# Altium schematic sheet УШЯИ.411618.029Э Э3 Лист 7.schdoc: УШЯИ.411618.029Э
size 420 x 297 mm; SheetNumber: 7; SheetTotal: 7; Time: УШЯИ.411618.029Э
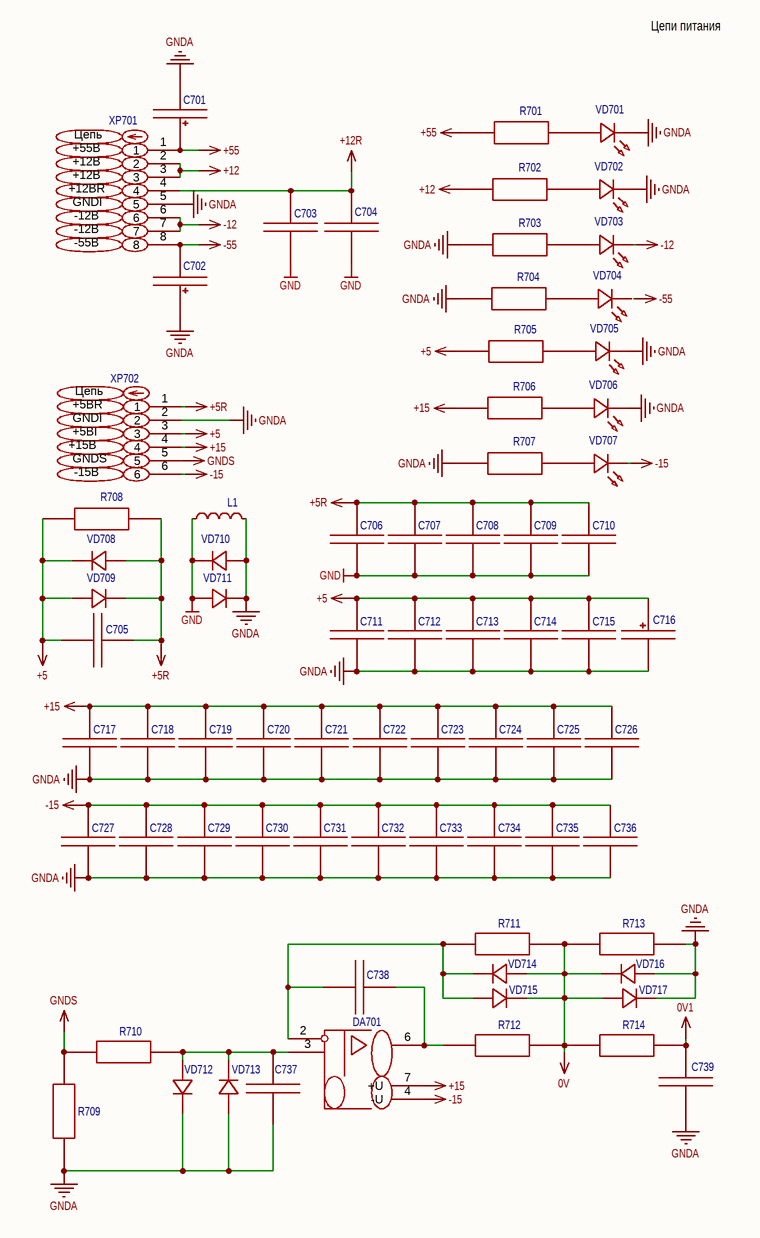
[diagram p0: УШЯИ.411618.029Э Э3 Лист 7.schdoc]

## Parts
C701  ECAP (К50-35), 4.7мкФ, 100В, 105°C, 5x11, p:2мм  [CAP-TH_BD5.0-P2.00-D0.8-FD]  (value not drawn)
C702  ECAP (К50-35), 4.7мкФ, 100В, 105°C, 5x11, p:2мм  [CAP-TH_BD5.0-P2.00-D0.8-FD]  (value not drawn)
C703  Конденсатор SMD 1мкФ 100В X7R 10% [0805]  [C0805]  (value not drawn)
C704  Конденсатор SMD 1мкФ 100В X7R 10% [0805]  [C0805]  (value not drawn)
C705  Конденсатор SMD 3300пФ 100В X7R 10% [0805]  [C0805]  (value not drawn)
C706  Конденсатор SMD 0,33мкФ 100В X7R 10% [0805]  [C0805]  (value not drawn)
C707  Конденсатор SMD 0,33мкФ 100В X7R 10% [0805]  [C0805]  (value not drawn)
C708  Конденсатор SMD 0,33мкФ 100В X7R 10% [0805]  [C0805]  (value not drawn)
C709  Конденсатор SMD 0,33мкФ 100В X7R 10% [0805]  [C0805]  (value not drawn)
C710  Конденсатор SMD 0,33мкФ 100В X7R 10% [0805]  [C0805]  (value not drawn)
C711  Конденсатор SMD 0,33мкФ 100В X7R 10% [0805]  [C0805]  (value not drawn)
C712  Конденсатор SMD 0,33мкФ 100В X7R 10% [0805]  [C0805]  (value not drawn)
C713  Конденсатор SMD 0,33мкФ 100В X7R 10% [0805]  [C0805]  (value not drawn)
C714  Конденсатор SMD 0,33мкФ 100В X7R 10% [0805]  [C0805]  (value not drawn)
C715  Конденсатор SMD 0,33мкФ 100В X7R 10% [0805]  [C0805]  (value not drawn)
C716  ECAP (К50-35), 4.7мкФ, 100В, 105°C, 5x11, p:2мм  [CAP-TH_BD5.0-P2.00-D0.8-FD]  (value not drawn)
C717  Конденсатор SMD 0,33мкФ 100В X7R 10% [0805]  [C0805]  (value not drawn)
C718  Конденсатор SMD 0,33мкФ 100В X7R 10% [0805]  [C0805]  (value not drawn)
C719  Конденсатор SMD 0,33мкФ 100В X7R 10% [0805]  [C0805]  (value not drawn)
C720  Конденсатор SMD 0,33мкФ 100В X7R 10% [0805]  [C0805]  (value not drawn)
C721  Конденсатор SMD 0,33мкФ 100В X7R 10% [0805]  [C0805]  (value not drawn)
C722  Конденсатор SMD 0,33мкФ 100В X7R 10% [0805]  [C0805]  (value not drawn)
C723  Конденсатор SMD 0,33мкФ 100В X7R 10% [0805]  [C0805]  (value not drawn)
C724  Конденсатор SMD 0,33мкФ 100В X7R 10% [0805]  [C0805]  (value not drawn)
C725  Конденсатор SMD 0,33мкФ 100В X7R 10% [0805]  [C0805]  (value not drawn)
C726  Конденсатор SMD 0,33мкФ 100В X7R 10% [0805]  [C0805]  (value not drawn)
C727  Конденсатор SMD 0,33мкФ 100В X7R 10% [0805]  [C0805]  (value not drawn)
C728  Конденсатор SMD 0,33мкФ 100В X7R 10% [0805]  [C0805]  (value not drawn)
C729  Конденсатор SMD 0,33мкФ 100В X7R 10% [0805]  [C0805]  (value not drawn)
C730  Конденсатор SMD 0,33мкФ 100В X7R 10% [0805]  [C0805]  (value not drawn)
C731  Конденсатор SMD 0,33мкФ 100В X7R 10% [0805]  [C0805]  (value not drawn)
C732  Конденсатор SMD 0,33мкФ 100В X7R 10% [0805]  [C0805]  (value not drawn)
C733  Конденсатор SMD 0,33мкФ 100В X7R 10% [0805]  [C0805]  (value not drawn)
C734  Конденсатор SMD 0,33мкФ 100В X7R 10% [0805]  [C0805]  (value not drawn)
C735  Конденсатор SMD 0,33мкФ 100В X7R 10% [0805]  [C0805]  (value not drawn)
C736  Конденсатор SMD 0,33мкФ 100В X7R 10% [0805]  [C0805]  (value not drawn)
C737  Конденсатор SMD 2,2мкФ 100В X7R 10% [0805]  [C0805]  (value not drawn)
C738  Конденсатор SMD 240пФ 100В X7R 10% [0805]  [C0805]  (value not drawn)
C739  Конденсатор SMD 680пФ 100В X7R 10% [0805]  [C0805]  (value not drawn)
DA701  Операционный усилитель AD8671ARZ [SOIC-8]  [SOIC-8_L4.9-W3.9-P1.27-LS6.0-BL]  (value not drawn)
L1  Дроссель LQH55DN101M01 [2220]  [L2220]  (value not drawn)
R701  Резистор 3кОм 0,125Вт 1% [0805]  [R0805]  (value not drawn)
R702  Резистор 510Ом 0,125Вт 1% [0805]  [R0805]  (value not drawn)
R703  Резистор 510Ом 0,125Вт 1% [0805]  [R0805]  (value not drawn)
R704  Резистор 3кОм 0,125Вт 1% [0805]  [R0805]  (value not drawn)
R705  Резистор 150Ом 0,125Вт 1% [0805]  [R0805]  (value not drawn)
R706  Резистор 1кОм 0,125Вт 1% [0805]  [R0805]  (value not drawn)
R707  Резистор 1кОм 0,125Вт 1% [0805]  [R0805]  (value not drawn)
R708  Резистор 240Ом 0,125Вт 1% [0805]  [R0805]  (value not drawn)
R709  Резистор 1,1кОм 0,125Вт 1% [0805]  [R0805]  (value not drawn)
R710  Резистор 1,1кОм 0,125Вт 1% [0805]  [R0805]  (value not drawn)
R711  Резистор 1,1кОм 0,125Вт 1% [0805]  [R0805]  (value not drawn)
R712  Резистор 22 кОм 0,125Вт 1% [0805]  [R0805]  (value not drawn)
R713  Резистор 330Ом 0,125Вт 1% [0805]  [R0805]  (value not drawn)
R714  Резистор 22 кОм 0,125Вт 1% [0805]  [R0805]  (value not drawn)
VD701  Светодиод YLED0805YG [0805]  [LED0805-R-RD]  (value not drawn)
VD702  Светодиод YLED0805YG [0805]  [LED0805-R-RD]  (value not drawn)
VD703  Светодиод YLED0805YG [0805]  [LED0805-R-RD]  (value not drawn)
VD704  Светодиод YLED0805YG [0805]  [LED0805-R-RD]  (value not drawn)
VD705  Светодиод YLED0805YG [0805]  [LED0805-R-RD]  (value not drawn)
VD706  Светодиод YLED0805YG [0805]  [LED0805-R-RD]  (value not drawn)
VD707  Светодиод YLED0805YG [0805]  [LED0805-R-RD]  (value not drawn)
VD708  Диод импульсный 1N4448 [SOD-123]  [SOD-123_L2.7-W1.6-LS3.7-RD-1]  (value not drawn)
VD709  Диод импульсный 1N4448 [SOD-123]  [SOD-123_L2.7-W1.6-LS3.7-RD-1]  (value not drawn)
VD710  Диод импульсный 1N4448 [SOD-123]  [SOD-123_L2.7-W1.6-LS3.7-RD-1]  (value not drawn)
VD711  Диод импульсный 1N4448 [SOD-123]  [SOD-123_L2.7-W1.6-LS3.7-RD-1]  (value not drawn)
VD712  Диод импульсный 1N4448 [SOD-123]  [SOD-123_L2.7-W1.6-LS3.7-RD-1]  (value not drawn)
VD713  Диод импульсный 1N4448 [SOD-123]  [SOD-123_L2.7-W1.6-LS3.7-RD-1]  (value not drawn)
VD714  Диод импульсный 1N4448 [SOD-123]  [SOD-123_L2.7-W1.6-LS3.7-RD-1]  (value not drawn)
VD715  Диод импульсный 1N4448 [SOD-123]  [SOD-123_L2.7-W1.6-LS3.7-RD-1]  (value not drawn)
VD716  Диод импульсный 1N4448 [SOD-123]  [SOD-123_L2.7-W1.6-LS3.7-RD-1]  (value not drawn)
VD717  Диод импульсный 1N4448 [SOD-123]  [SOD-123_L2.7-W1.6-LS3.7-RD-1]  (value not drawn)
XP701  Вилка на плату 280373-2 шаг 2.54мм  [CONN-TH_8P-P2.54_280373-1]  (value not drawn)
XP702  Вилка на плату 280372-2 шаг 2.54мм  [CONN-TH_DIP-6-2.54]  (value not drawn)

## Nets
0V: R711.1 R712.1 R713.2 R714.2 VD714.2(A) VD715.1(C) VD716.1(C) VD717.2(A)
0V1: C739.2 R714.1
+5: C705.2 C711.2 C712.2 C713.2 C714.2 C715.2 C716.1 R705.1 R708.1 VD708.1(C) VD709.2(A) XP702.3
+5R: C705.1 C706.2 C707.2 C708.2 C709.2 C710.2 R708.2 VD708.2(A) VD709.1(C) XP702.1
+12: R702.1 XP701.2 XP701.3
+12R: C703.2 C704.2 XP701.4
+15: C717.2 C718.2 C719.2 C720.2 C721.2 C722.2 C723.2 C724.2 C725.2 C726.2 DA701.7(+U) R706.1 XP702.4
+55: C701.1 R701.1 XP701.1
-12: VD703.2 XP701.6 XP701.7
-15: C727.2 C728.2 C729.2 C730.2 C731.2 C732.2 C733.2 C734.2 C735.2 C736.2 DA701.4(-U) VD707.2 XP702.6
-55: C702.2 XP701.8
GND: C703.1 C704.1 C706.1 C707.1 C708.1 C709.1 C710.1 L1.1 VD710.1(C) VD711.2(A)
GNDA: C701.2 C702.1 C711.1 C712.1 C713.1 C714.1 C715.1 C716.2 C717.1 C718.1 C719.1 C720.1 C721.1 C722.1 C723.1 C724.1 C725.1 C726.1 C727.1 C728.1 C729.1 C730.1 C731.1 C732.1 C733.1 C734.1 C735.1 C736.1 C737.2 C739.1 L1.2 R703.1 R704.1 R707.1 R709.2 R713.1 VD701.2 VD702.2 VD705.2 VD706.2 VD710.2(A) VD711.1(C) VD712.1(C) VD713.2(A) VD716.2(A) VD717.1(C) XP701.5 XP702.2
GNDS: R709.1 R710.2 XP702.5
NetC737_1: C737.1 DA701.3(+IN) R710.1 VD712.2(A) VD713.1(C)
NetC738_1: C738.1 DA701.2(-IN) R711.2 VD714.1(C) VD715.2(A)
NetC738_2: C738.2 DA701.6(OUT) R712.2
NetR701_2: R701.2 VD701.1
NetR702_2: R702.2 VD702.1
NetR703_2: R703.2 VD703.1
NetR704_2: R704.2 VD704.1
NetR705_2: R705.2 VD705.1
NetR706_2: R706.2 VD706.1
NetR707_2: R707.2 VD707.1

Not connected (* = marked no-connect by the designer): VD704 2

## Notes on the sheet
- Цепи питания
- (near XP701) +55B
- (near XP701) +12B
- (near XP701) +12BR
- (near XP701) GNDI
- (near XP701) -12B
- (near XP701) -55B
- +15B
- +5BI
- (near XP702) GNDI
- (near XP702) +5BR
- GNDS
- -15B
- Подп. и дата
- Инв.№ дубл.
- Взам.инв.№
- Подп.и дата
- Инв.№ подл.
- Изм.
- Лист
- № докум.
- Подп.
- Дата
- Формат  A3
- (in symbol Вилка на плату 280372-2 шаг 2.54мм) Цепь
- (in symbol Вилка на плату 280373-2 шаг 2.54мм) Цепь

## Library data of the parts
C701 = ECAP (К50-35), 4.7мкФ, 100В, 105°C, 5x11, p:2мм: Manufacturer: Chengx; nameAlias: Value; Contributor: jordanjin; Convert to PCB: yes; UniqueId: ggec79a695c238429b4; Origin Footprint: CAP-TH_BD5.0-P2.00-D0.8-FD; Device: ECAP (К50-35), 4.7мкФ, 100В, 105°C, 5x11, p:2мм; Symbol: ECAP (К50-35), 4.7мкФ, 100В, 105°C, 5x11, p:2мм; Supplier: LCSC; Manufacturer Part: ECAP (К50-35), 4.7мкФ, 100В, 105°C, 5x11, p:2мм; JLCPCB Part Class: Extended Part; spicePre: C; spiceSymbolName: ECAP (К50-35), 4.7мкФ, 100В, 105°C, 5x11, p:2мм; Add into BOM: yes; FootprintName: CAP-TH_BD5.0-P2.00-D0.8-FD
C702 = ECAP (К50-35), 4.7мкФ, 100В, 105°C, 5x11, p:2мм: Manufacturer: Chengx; nameAlias: Value; Contributor: jordanjin; Convert to PCB: yes; UniqueId: ggeb00718f5b1f7dec1; Origin Footprint: CAP-TH_BD5.0-P2.00-D0.8-FD; Device: ECAP (К50-35), 4.7мкФ, 100В, 105°C, 5x11, p:2мм; Symbol: ECAP (К50-35), 4.7мкФ, 100В, 105°C, 5x11, p:2мм; Supplier: LCSC; Manufacturer Part: ECAP (К50-35), 4.7мкФ, 100В, 105°C, 5x11, p:2мм; JLCPCB Part Class: Extended Part; spicePre: C; spiceSymbolName: ECAP (К50-35), 4.7мкФ, 100В, 105°C, 5x11, p:2мм; Add into BOM: yes; FootprintName: CAP-TH_BD5.0-P2.00-D0.8-FD
C703 = Конденсатор SMD 1мкФ 100В X7R 10% [0805]: Contributor: jordanjin; Convert to PCB: yes; UniqueId: gged413f6c6ee1c06eb; Origin Footprint: C0805; Device: Конденсатор SMD 1мкФ 100В X7R 10% [0805]; Symbol: Конденсатор SMD 1мкФ 100В X7R 10% [0805]; Manufacturer Part: C0805; spicePre: C; spiceSymbolName: Конденсатор SMD 100нФ 100В X7R 10% [0805]; Add into BOM: yes; FootprintName: C0805
C704 = Конденсатор SMD 1мкФ 100В X7R 10% [0805]: Contributor: jordanjin; Convert to PCB: yes; UniqueId: gge57e83f5dac66d963; Origin Footprint: C0805; Device: Конденсатор SMD 1мкФ 100В X7R 10% [0805]; Symbol: Конденсатор SMD 1мкФ 100В X7R 10% [0805]; Manufacturer Part: C0805; spicePre: C; spiceSymbolName: Конденсатор SMD 100нФ 100В X7R 10% [0805]; Add into BOM: yes; FootprintName: C0805
C705 = Конденсатор SMD 3300пФ 100В X7R 10% [0805]: Contributor: jordanjin; Convert to PCB: yes; UniqueId: gge41996877947d4b8f; Origin Footprint: C0805; Device: Конденсатор SMD 3300пФ 100В X7R 10% [0805]; Symbol: Конденсатор SMD 3300пФ 100В X7R 10% [0805]; Manufacturer Part: C0805; spicePre: C; spiceSymbolName: Конденсатор SMD 100нФ 100В X7R 10% [0805]; Add into BOM: yes; FootprintName: C0805
C706 = Конденсатор SMD 0,33мкФ 100В X7R 10% [0805]: Contributor: jordanjin; Convert to PCB: yes; UniqueId: gge2c99e2c9b5d02610; Origin Footprint: C0805; Device: Конденсатор SMD 0,33мкФ 100В X7R 10% [0805]; Symbol: Конденсатор SMD 0,33мкФ 100В X7R 10% [0805]; Manufacturer Part: C0805; spicePre: C; spiceSymbolName: Конденсатор SMD 100нФ 100В X7R 10% [0805]; Add into BOM: yes; FootprintName: C0805
C707 = Конденсатор SMD 0,33мкФ 100В X7R 10% [0805]: Contributor: jordanjin; Convert to PCB: yes; UniqueId: gge8f710507705d2100; Origin Footprint: C0805; Device: Конденсатор SMD 0,33мкФ 100В X7R 10% [0805]; Symbol: Конденсатор SMD 0,33мкФ 100В X7R 10% [0805]; Manufacturer Part: C0805; spicePre: C; spiceSymbolName: Конденсатор SMD 100нФ 100В X7R 10% [0805]; Add into BOM: yes; FootprintName: C0805
C708 = Конденсатор SMD 0,33мкФ 100В X7R 10% [0805]: Contributor: jordanjin; Convert to PCB: yes; UniqueId: gge978881400ca0cd87; Origin Footprint: C0805; Device: Конденсатор SMD 0,33мкФ 100В X7R 10% [0805]; Symbol: Конденсатор SMD 0,33мкФ 100В X7R 10% [0805]; Manufacturer Part: C0805; spicePre: C; spiceSymbolName: Конденсатор SMD 100нФ 100В X7R 10% [0805]; Add into BOM: yes; FootprintName: C0805
C709 = Конденсатор SMD 0,33мкФ 100В X7R 10% [0805]: Contributor: jordanjin; Convert to PCB: yes; UniqueId: ggeffa3e215b4406635; Origin Footprint: C0805; Device: Конденсатор SMD 0,33мкФ 100В X7R 10% [0805]; Symbol: Конденсатор SMD 0,33мкФ 100В X7R 10% [0805]; Manufacturer Part: C0805; spicePre: C; spiceSymbolName: Конденсатор SMD 100нФ 100В X7R 10% [0805]; Add into BOM: yes; FootprintName: C0805
C710 = Конденсатор SMD 0,33мкФ 100В X7R 10% [0805]: Contributor: jordanjin; Convert to PCB: yes; UniqueId: ggee3b30f4a3e05f17b; Origin Footprint: C0805; Device: Конденсатор SMD 0,33мкФ 100В X7R 10% [0805]; Symbol: Конденсатор SMD 0,33мкФ 100В X7R 10% [0805]; Manufacturer Part: C0805; spicePre: C; spiceSymbolName: Конденсатор SMD 100нФ 100В X7R 10% [0805]; Add into BOM: yes; FootprintName: C0805
C711 = Конденсатор SMD 0,33мкФ 100В X7R 10% [0805]: Contributor: jordanjin; Convert to PCB: yes; UniqueId: gge0fe80393a9613bd8; Origin Footprint: C0805; Device: Конденсатор SMD 0,33мкФ 100В X7R 10% [0805]; Symbol: Конденсатор SMD 0,33мкФ 100В X7R 10% [0805]; Manufacturer Part: C0805; spicePre: C; spiceSymbolName: Конденсатор SMD 100нФ 100В X7R 10% [0805]; Add into BOM: yes; FootprintName: C0805
C712 = Конденсатор SMD 0,33мкФ 100В X7R 10% [0805]: Contributor: jordanjin; Convert to PCB: yes; UniqueId: gge0eb5b0418183ff51; Origin Footprint: C0805; Device: Конденсатор SMD 0,33мкФ 100В X7R 10% [0805]; Symbol: Конденсатор SMD 0,33мкФ 100В X7R 10% [0805]; Manufacturer Part: C0805; spicePre: C; spiceSymbolName: Конденсатор SMD 100нФ 100В X7R 10% [0805]; Add into BOM: yes; FootprintName: C0805
C713 = Конденсатор SMD 0,33мкФ 100В X7R 10% [0805]: Contributor: jordanjin; Convert to PCB: yes; UniqueId: gge76f04a7dbfea72d7; Origin Footprint: C0805; Device: Конденсатор SMD 0,33мкФ 100В X7R 10% [0805]; Symbol: Конденсатор SMD 0,33мкФ 100В X7R 10% [0805]; Manufacturer Part: C0805; spicePre: C; spiceSymbolName: Конденсатор SMD 100нФ 100В X7R 10% [0805]; Add into BOM: yes; FootprintName: C0805
C714 = Конденсатор SMD 0,33мкФ 100В X7R 10% [0805]: Contributor: jordanjin; Convert to PCB: yes; UniqueId: gge51ad3bbaa36013da; Origin Footprint: C0805; Device: Конденсатор SMD 0,33мкФ 100В X7R 10% [0805]; Symbol: Конденсатор SMD 0,33мкФ 100В X7R 10% [0805]; Manufacturer Part: C0805; spicePre: C; spiceSymbolName: Конденсатор SMD 100нФ 100В X7R 10% [0805]; Add into BOM: yes; FootprintName: C0805
C715 = Конденсатор SMD 0,33мкФ 100В X7R 10% [0805]: Contributor: jordanjin; Convert to PCB: yes; UniqueId: ggea0d1a34ba46ee456; Origin Footprint: C0805; Device: Конденсатор SMD 0,33мкФ 100В X7R 10% [0805]; Symbol: Конденсатор SMD 0,33мкФ 100В X7R 10% [0805]; Manufacturer Part: C0805; spicePre: C; spiceSymbolName: Конденсатор SMD 100нФ 100В X7R 10% [0805]; Add into BOM: yes; FootprintName: C0805
C716 = ECAP (К50-35), 4.7мкФ, 100В, 105°C, 5x11, p:2мм: Manufacturer: Chengx; nameAlias: Value; Contributor: jordanjin; Convert to PCB: yes; UniqueId: gge8b239ae06b28e32d; Origin Footprint: CAP-TH_BD5.0-P2.00-D0.8-FD; Device: ECAP (К50-35), 4.7мкФ, 100В, 105°C, 5x11, p:2мм; Symbol: ECAP (К50-35), 4.7мкФ, 100В, 105°C, 5x11, p:2мм; Supplier: LCSC; Manufacturer Part: ECAP (К50-35), 4.7мкФ, 100В, 105°C, 5x11, p:2мм; JLCPCB Part Class: Extended Part; spicePre: C; spiceSymbolName: ECAP (К50-35), 4.7мкФ, 100В, 105°C, 5x11, p:2мм; Add into BOM: yes; FootprintName: CAP-TH_BD5.0-P2.00-D0.8-FD
C717 = Конденсатор SMD 0,33мкФ 100В X7R 10% [0805]: Contributor: jordanjin; Convert to PCB: yes; UniqueId: gge8d6ecc52b212946c; Origin Footprint: C0805; Device: Конденсатор SMD 0,33мкФ 100В X7R 10% [0805]; Symbol: Конденсатор SMD 0,33мкФ 100В X7R 10% [0805]; Manufacturer Part: C0805; spicePre: C; spiceSymbolName: Конденсатор SMD 100нФ 100В X7R 10% [0805]; Add into BOM: yes; FootprintName: C0805
C718 = Конденсатор SMD 0,33мкФ 100В X7R 10% [0805]: Contributor: jordanjin; Convert to PCB: yes; UniqueId: ggeb263bc4d5c0757bd; Origin Footprint: C0805; Device: Конденсатор SMD 0,33мкФ 100В X7R 10% [0805]; Symbol: Конденсатор SMD 0,33мкФ 100В X7R 10% [0805]; Manufacturer Part: C0805; spicePre: C; spiceSymbolName: Конденсатор SMD 100нФ 100В X7R 10% [0805]; Add into BOM: yes; FootprintName: C0805
C719 = Конденсатор SMD 0,33мкФ 100В X7R 10% [0805]: Contributor: jordanjin; Convert to PCB: yes; UniqueId: gge8279ce7d3c195481; Origin Footprint: C0805; Device: Конденсатор SMD 0,33мкФ 100В X7R 10% [0805]; Symbol: Конденсатор SMD 0,33мкФ 100В X7R 10% [0805]; Manufacturer Part: C0805; spicePre: C; spiceSymbolName: Конденсатор SMD 100нФ 100В X7R 10% [0805]; Add into BOM: yes; FootprintName: C0805
C720 = Конденсатор SMD 0,33мкФ 100В X7R 10% [0805]: Contributor: jordanjin; Convert to PCB: yes; UniqueId: ggef2a808055042e68f; Origin Footprint: C0805; Device: Конденсатор SMD 0,33мкФ 100В X7R 10% [0805]; Symbol: Конденсатор SMD 0,33мкФ 100В X7R 10% [0805]; Manufacturer Part: C0805; spicePre: C; spiceSymbolName: Конденсатор SMD 100нФ 100В X7R 10% [0805]; Add into BOM: yes; FootprintName: C0805
C721 = Конденсатор SMD 0,33мкФ 100В X7R 10% [0805]: Contributor: jordanjin; Convert to PCB: yes; UniqueId: gge29bc8f4a845388a2; Origin Footprint: C0805; Device: Конденсатор SMD 0,33мкФ 100В X7R 10% [0805]; Symbol: Конденсатор SMD 0,33мкФ 100В X7R 10% [0805]; Manufacturer Part: C0805; spicePre: C; spiceSymbolName: Конденсатор SMD 100нФ 100В X7R 10% [0805]; Add into BOM: yes; FootprintName: C0805
C722 = Конденсатор SMD 0,33мкФ 100В X7R 10% [0805]: Contributor: jordanjin; Convert to PCB: yes; UniqueId: gge53ad9dcacc4a4841; Origin Footprint: C0805; Device: Конденсатор SMD 0,33мкФ 100В X7R 10% [0805]; Symbol: Конденсатор SMD 0,33мкФ 100В X7R 10% [0805]; Manufacturer Part: C0805; spicePre: C; spiceSymbolName: Конденсатор SMD 100нФ 100В X7R 10% [0805]; Add into BOM: yes; FootprintName: C0805
C723 = Конденсатор SMD 0,33мкФ 100В X7R 10% [0805]: Contributor: jordanjin; Convert to PCB: yes; UniqueId: gge50c4013cebd6c9c5; Origin Footprint: C0805; Device: Конденсатор SMD 0,33мкФ 100В X7R 10% [0805]; Symbol: Конденсатор SMD 0,33мкФ 100В X7R 10% [0805]; Manufacturer Part: C0805; spicePre: C; spiceSymbolName: Конденсатор SMD 100нФ 100В X7R 10% [0805]; Add into BOM: yes; FootprintName: C0805
C724 = Конденсатор SMD 0,33мкФ 100В X7R 10% [0805]: Contributor: jordanjin; Convert to PCB: yes; UniqueId: ggeb9b96117afb50d93; Origin Footprint: C0805; Device: Конденсатор SMD 0,33мкФ 100В X7R 10% [0805]; Symbol: Конденсатор SMD 0,33мкФ 100В X7R 10% [0805]; Manufacturer Part: C0805; spicePre: C; spiceSymbolName: Конденсатор SMD 100нФ 100В X7R 10% [0805]; Add into BOM: yes; FootprintName: C0805
C725 = Конденсатор SMD 0,33мкФ 100В X7R 10% [0805]: Contributor: jordanjin; Convert to PCB: yes; UniqueId: gge849b9b6f05694942; Origin Footprint: C0805; Device: Конденсатор SMD 0,33мкФ 100В X7R 10% [0805]; Symbol: Конденсатор SMD 0,33мкФ 100В X7R 10% [0805]; Manufacturer Part: C0805; spicePre: C; spiceSymbolName: Конденсатор SMD 100нФ 100В X7R 10% [0805]; Add into BOM: yes; FootprintName: C0805
C726 = Конденсатор SMD 0,33мкФ 100В X7R 10% [0805]: Contributor: jordanjin; Convert to PCB: yes; UniqueId: gge7941181534d7c05c; Origin Footprint: C0805; Device: Конденсатор SMD 0,33мкФ 100В X7R 10% [0805]; Symbol: Конденсатор SMD 0,33мкФ 100В X7R 10% [0805]; Manufacturer Part: C0805; spicePre: C; spiceSymbolName: Конденсатор SMD 100нФ 100В X7R 10% [0805]; Add into BOM: yes; FootprintName: C0805
C727 = Конденсатор SMD 0,33мкФ 100В X7R 10% [0805]: Contributor: jordanjin; Convert to PCB: yes; UniqueId: ggee7ac6d5a3b31e9d6; Origin Footprint: C0805; Device: Конденсатор SMD 0,33мкФ 100В X7R 10% [0805]; Symbol: Конденсатор SMD 0,33мкФ 100В X7R 10% [0805]; Manufacturer Part: C0805; spicePre: C; spiceSymbolName: Конденсатор SMD 100нФ 100В X7R 10% [0805]; Add into BOM: yes; FootprintName: C0805
C728 = Конденсатор SMD 0,33мкФ 100В X7R 10% [0805]: Contributor: jordanjin; Convert to PCB: yes; UniqueId: gge3b117698605ce8f9; Origin Footprint: C0805; Device: Конденсатор SMD 0,33мкФ 100В X7R 10% [0805]; Symbol: Конденсатор SMD 0,33мкФ 100В X7R 10% [0805]; Manufacturer Part: C0805; spicePre: C; spiceSymbolName: Конденсатор SMD 100нФ 100В X7R 10% [0805]; Add into BOM: yes; FootprintName: C0805
C729 = Конденсатор SMD 0,33мкФ 100В X7R 10% [0805]: Contributor: jordanjin; Convert to PCB: yes; UniqueId: ggec6c710e3fae7596f; Origin Footprint: C0805; Device: Конденсатор SMD 0,33мкФ 100В X7R 10% [0805]; Symbol: Конденсатор SMD 0,33мкФ 100В X7R 10% [0805]; Manufacturer Part: C0805; spicePre: C; spiceSymbolName: Конденсатор SMD 100нФ 100В X7R 10% [0805]; Add into BOM: yes; FootprintName: C0805
C730 = Конденсатор SMD 0,33мкФ 100В X7R 10% [0805]: Contributor: jordanjin; Convert to PCB: yes; UniqueId: gged6096b43feaa1135; Origin Footprint: C0805; Device: Конденсатор SMD 0,33мкФ 100В X7R 10% [0805]; Symbol: Конденсатор SMD 0,33мкФ 100В X7R 10% [0805]; Manufacturer Part: C0805; spicePre: C; spiceSymbolName: Конденсатор SMD 100нФ 100В X7R 10% [0805]; Add into BOM: yes; FootprintName: C0805
C731 = Конденсатор SMD 0,33мкФ 100В X7R 10% [0805]: Contributor: jordanjin; Convert to PCB: yes; UniqueId: gge6db5aa1f37674ae5; Origin Footprint: C0805; Device: Конденсатор SMD 0,33мкФ 100В X7R 10% [0805]; Symbol: Конденсатор SMD 0,33мкФ 100В X7R 10% [0805]; Manufacturer Part: C0805; spicePre: C; spiceSymbolName: Конденсатор SMD 100нФ 100В X7R 10% [0805]; Add into BOM: yes; FootprintName: C0805
C732 = Конденсатор SMD 0,33мкФ 100В X7R 10% [0805]: Contributor: jordanjin; Convert to PCB: yes; UniqueId: ggeae336647d1fef108; Origin Footprint: C0805; Device: Конденсатор SMD 0,33мкФ 100В X7R 10% [0805]; Symbol: Конденсатор SMD 0,33мкФ 100В X7R 10% [0805]; Manufacturer Part: C0805; spicePre: C; spiceSymbolName: Конденсатор SMD 100нФ 100В X7R 10% [0805]; Add into BOM: yes; FootprintName: C0805
C733 = Конденсатор SMD 0,33мкФ 100В X7R 10% [0805]: Contributor: jordanjin; Convert to PCB: yes; UniqueId: gge73da1928ca5fe88b; Origin Footprint: C0805; Device: Конденсатор SMD 0,33мкФ 100В X7R 10% [0805]; Symbol: Конденсатор SMD 0,33мкФ 100В X7R 10% [0805]; Manufacturer Part: C0805; spicePre: C; spiceSymbolName: Конденсатор SMD 100нФ 100В X7R 10% [0805]; Add into BOM: yes; FootprintName: C0805
C734 = Конденсатор SMD 0,33мкФ 100В X7R 10% [0805]: Contributor: jordanjin; Convert to PCB: yes; UniqueId: gge35dd7582ea89825b; Origin Footprint: C0805; Device: Конденсатор SMD 0,33мкФ 100В X7R 10% [0805]; Symbol: Конденсатор SMD 0,33мкФ 100В X7R 10% [0805]; Manufacturer Part: C0805; spicePre: C; spiceSymbolName: Конденсатор SMD 100нФ 100В X7R 10% [0805]; Add into BOM: yes; FootprintName: C0805
C735 = Конденсатор SMD 0,33мкФ 100В X7R 10% [0805]: Contributor: jordanjin; Convert to PCB: yes; UniqueId: ggefea48fbf2fcabb1a; Origin Footprint: C0805; Device: Конденсатор SMD 0,33мкФ 100В X7R 10% [0805]; Symbol: Конденсатор SMD 0,33мкФ 100В X7R 10% [0805]; Manufacturer Part: C0805; spicePre: C; spiceSymbolName: Конденсатор SMD 100нФ 100В X7R 10% [0805]; Add into BOM: yes; FootprintName: C0805
C736 = Конденсатор SMD 0,33мкФ 100В X7R 10% [0805]: Contributor: jordanjin; Convert to PCB: yes; UniqueId: gged22cf9e48ac49b50; Origin Footprint: C0805; Device: Конденсатор SMD 0,33мкФ 100В X7R 10% [0805]; Symbol: Конденсатор SMD 0,33мкФ 100В X7R 10% [0805]; Manufacturer Part: C0805; spicePre: C; spiceSymbolName: Конденсатор SMD 100нФ 100В X7R 10% [0805]; Add into BOM: yes; FootprintName: C0805
C737 = Конденсатор SMD 2,2мкФ 100В X7R 10% [0805]: Contributor: jordanjin; Convert to PCB: yes; UniqueId: gge6dfac0ba330344ad; Origin Footprint: C0805; Device: Конденсатор SMD 2,2мкФ 100В X7R 10% [0805]; Symbol: Конденсатор SMD 2,2мкФ 100В X7R 10% [0805]; Manufacturer Part: C0805; spicePre: C; spiceSymbolName: Конденсатор SMD 100нФ 100В X7R 10% [0805]; Add into BOM: yes; FootprintName: C0805
C738 = Конденсатор SMD 240пФ 100В X7R 10% [0805]: Contributor: jordanjin; Convert to PCB: yes; UniqueId: ggec159c05867b449a9; Origin Footprint: C0805; Device: Конденсатор SMD 240пФ 100В X7R 10% [0805]; Symbol: Конденсатор SMD 240пФ 100В X7R 10% [0805]; Manufacturer Part: C0805; spicePre: C; spiceSymbolName: Конденсатор SMD 100нФ 100В X7R 10% [0805]; Add into BOM: yes; FootprintName: C0805
C739 = Конденсатор SMD 680пФ 100В X7R 10% [0805]: Contributor: jordanjin; Convert to PCB: yes; UniqueId: gge5808c3601932fb95; Origin Footprint: C0805; Device: Конденсатор SMD 680пФ 100В X7R 10% [0805]; Symbol: Конденсатор SMD 680пФ 100В X7R 10% [0805]; Manufacturer Part: C0805; spicePre: C; spiceSymbolName: Конденсатор SMD 100нФ 100В X7R 10% [0805]; Add into BOM: yes; FootprintName: C0805
DA701 = Операционный усилитель AD8671ARZ [SOIC-8]: Manufacturer: Analog Devices; Manufacturer Part: AD8671ARZ-REEL7; Contributor: jordanjin; Convert to PCB: yes; UniqueId: gge78f650f834d7221e; Origin Footprint: SOIC-8_L4.9-W3.9-P1.27-LS6.0-BL; Device: Операционный усилитель AD8671ARZ [SOIC-8]; Symbol: Операционный усилитель AD8671ARZ [SOIC-8]; Supplier: LCSC; Supplier Part: C56309; JLCPCB Part Class: Extended Part; spicePre: D; spiceSymbolName: Операционный усилитель AD8671ARZ [SOIC-8]; Add into BOM: yes; FootprintName: SOIC-8_L4.9-W3.9-P1.27-LS6.0-BL
L1 = Дроссель LQH55DN101M01 [2220]: Manufacturer: muRata(村田); nameAlias: Value; Convert to PCB: yes; UniqueId: ggee184eee05c7c2950; ModelId: d4c6f97e303e4b1b8669f70e4026b0f7; Origin Footprint: L2220; Device: Дроссель LQH55DN101M01 [2220]; Symbol: Дроссель LQH55DN101M01 [2220]; Supplier: LCSC; Manufacturer Part: LQH55DN101M01; Supplier Part: C98028; JLCPCB Part Class: Extended Part; spicePre: L; spiceSymbolName: LQH55DN2R2M03L; Add into BOM: yes; FootprintName: L2220; ModelName: L2220
R701 = Резистор 3кОм 0,125Вт 1% [0805]: Contributor: jordanjin; Convert to PCB: yes; UniqueId: gge43217f4089893af2; ModelId: de27d504f5024d53a3020ec2611f5e5e; Origin Footprint: R0805; Device: Резистор 3кОм 0,125Вт 1% [0805]; Symbol: Резистор 3кОм 0,125Вт 1% [0805]; Manufacturer Part: R0805; spicePre: R; spiceSymbolName: Резистор 12кОм 0,125Вт 1% [0805]; Add into BOM: yes; FootprintName: R0805; ModelName: R0805
R702 = Резистор 510Ом 0,125Вт 1% [0805]: Contributor: jordanjin; Convert to PCB: yes; UniqueId: gge284e1c5059f7e2ae; ModelId: de27d504f5024d53a3020ec2611f5e5e; Origin Footprint: R0805; Device: Резистор 510Ом 0,125Вт 1% [0805]; Symbol: Резистор 510Ом 0,125Вт 1% [0805]; Manufacturer Part: R0805; spicePre: R; spiceSymbolName: Резистор 12кОм 0,125Вт 1% [0805]; Add into BOM: yes; FootprintName: R0805; ModelName: R0805
R703 = Резистор 510Ом 0,125Вт 1% [0805]: Contributor: jordanjin; Convert to PCB: yes; UniqueId: gge58c90d0d9cd8ac62; ModelId: de27d504f5024d53a3020ec2611f5e5e; Origin Footprint: R0805; Device: Резистор 510Ом 0,125Вт 1% [0805]; Symbol: Резистор 510Ом 0,125Вт 1% [0805]; Manufacturer Part: R0805; spicePre: R; spiceSymbolName: Резистор 12кОм 0,125Вт 1% [0805]; Add into BOM: yes; FootprintName: R0805; ModelName: R0805
R704 = Резистор 3кОм 0,125Вт 1% [0805]: Contributor: jordanjin; Convert to PCB: yes; UniqueId: ggeaab650e8fc34881c; ModelId: de27d504f5024d53a3020ec2611f5e5e; Origin Footprint: R0805; Device: Резистор 3кОм 0,125Вт 1% [0805]; Symbol: Резистор 3кОм 0,125Вт 1% [0805]; Manufacturer Part: R0805; spicePre: R; spiceSymbolName: Резистор 12кОм 0,125Вт 1% [0805]; Add into BOM: yes; FootprintName: R0805; ModelName: R0805
R705 = Резистор 150Ом 0,125Вт 1% [0805]: Contributor: jordanjin; Convert to PCB: yes; UniqueId: ggec79f2e6d23617b05; ModelId: de27d504f5024d53a3020ec2611f5e5e; Origin Footprint: R0805; Device: Резистор 150Ом 0,125Вт 1% [0805]; Symbol: Резистор 150Ом 0,125Вт 1% [0805]; Manufacturer Part: R0805; spicePre: R; spiceSymbolName: Резистор 12кОм 0,125Вт 1% [0805]; Add into BOM: yes; FootprintName: R0805; ModelName: R0805
R706 = Резистор 1кОм 0,125Вт 1% [0805]: Contributor: jordanjin; Convert to PCB: yes; UniqueId: ggeb2fe6381541c2f72; ModelId: de27d504f5024d53a3020ec2611f5e5e; Origin Footprint: R0805; Device: Резистор 1кОм 0,125Вт 1% [0805]; Symbol: Резистор 1кОм 0,125Вт 1% [0805]; Manufacturer Part: R0805; spicePre: R; spiceSymbolName: Резистор 12кОм 0,125Вт 1% [0805]; Add into BOM: yes; FootprintName: R0805; ModelName: R0805
R707 = Резистор 1кОм 0,125Вт 1% [0805]: Contributor: jordanjin; Convert to PCB: yes; UniqueId: ggecb5f57eef41c6717; ModelId: de27d504f5024d53a3020ec2611f5e5e; Origin Footprint: R0805; Device: Резистор 1кОм 0,125Вт 1% [0805]; Symbol: Резистор 1кОм 0,125Вт 1% [0805]; Manufacturer Part: R0805; spicePre: R; spiceSymbolName: Резистор 12кОм 0,125Вт 1% [0805]; Add into BOM: yes; FootprintName: R0805; ModelName: R0805
R708 = Резистор 240Ом 0,125Вт 1% [0805]: Contributor: jordanjin; Convert to PCB: yes; UniqueId: ggea8d3a274c1fa2749; ModelId: de27d504f5024d53a3020ec2611f5e5e; Origin Footprint: R0805; Device: Резистор 240Ом 0,125Вт 1% [0805]; Symbol: Резистор 240Ом 0,125Вт 1% [0805]; Manufacturer Part: R0805; spicePre: R; spiceSymbolName: Резистор 12кОм 0,125Вт 1% [0805]; Add into BOM: yes; FootprintName: R0805; ModelName: R0805
R709 = Резистор 1,1кОм 0,125Вт 1% [0805]: Contributor: jordanjin; Convert to PCB: yes; UniqueId: gge873c7a4e0105d2a6; ModelId: de27d504f5024d53a3020ec2611f5e5e; Origin Footprint: R0805; Device: Резистор 1,1кОм 0,125Вт 1% [0805]; Symbol: Резистор 1,1кОм 0,125Вт 1% [0805]; Manufacturer Part: R0805; spicePre: R; spiceSymbolName: Резистор 12кОм 0,125Вт 1% [0805]; Add into BOM: yes; FootprintName: R0805; ModelName: R0805
R710 = Резистор 1,1кОм 0,125Вт 1% [0805]: Contributor: jordanjin; Convert to PCB: yes; UniqueId: ggec71cb4efdf79faee; ModelId: de27d504f5024d53a3020ec2611f5e5e; Origin Footprint: R0805; Device: Резистор 1,1кОм 0,125Вт 1% [0805]; Symbol: Резистор 1,1кОм 0,125Вт 1% [0805]; Manufacturer Part: R0805; spicePre: R; spiceSymbolName: Резистор 12кОм 0,125Вт 1% [0805]; Add into BOM: yes; FootprintName: R0805; ModelName: R0805
R711 = Резистор 1,1кОм 0,125Вт 1% [0805]: Contributor: jordanjin; Convert to PCB: yes; UniqueId: gge1624153f8bd25bdd; ModelId: de27d504f5024d53a3020ec2611f5e5e; Origin Footprint: R0805; Device: Резистор 1,1кОм 0,125Вт 1% [0805]; Symbol: Резистор 1,1кОм 0,125Вт 1% [0805]; Manufacturer Part: R0805; spicePre: R; spiceSymbolName: Резистор 12кОм 0,125Вт 1% [0805]; Add into BOM: yes; FootprintName: R0805; ModelName: R0805
R712 = Резистор 22 кОм 0,125Вт 1% [0805]: Contributor: jordanjin; Convert to PCB: yes; UniqueId: gge59b4ad0cd21c86e3; ModelId: de27d504f5024d53a3020ec2611f5e5e; Origin Footprint: R0805; Device: Резистор 22 кОм 0,125Вт 1% [0805]; Symbol: Резистор 22 кОм 0,125Вт 1% [0805]; Manufacturer Part: R0805; spicePre: R; spiceSymbolName: Резистор 12кОм 0,125Вт 1% [0805]; Add into BOM: yes; FootprintName: R0805; ModelName: R0805
R713 = Резистор 330Ом 0,125Вт 1% [0805]: Contributor: jordanjin; Convert to PCB: yes; UniqueId: gge643a68299698a0f2; ModelId: de27d504f5024d53a3020ec2611f5e5e; Origin Footprint: R0805; Device: Резистор 330Ом 0,125Вт 1% [0805]; Symbol: Резистор 330Ом 0,125Вт 1% [0805]; Manufacturer Part: R0805; spicePre: R; spiceSymbolName: Резистор 12кОм 0,125Вт 1% [0805]; Add into BOM: yes; FootprintName: R0805; ModelName: R0805
R714 = Резистор 22 кОм 0,125Вт 1% [0805]: Contributor: jordanjin; Convert to PCB: yes; UniqueId: gged6f42afeb700bb21; ModelId: de27d504f5024d53a3020ec2611f5e5e; Origin Footprint: R0805; Device: Резистор 22 кОм 0,125Вт 1% [0805]; Symbol: Резистор 22 кОм 0,125Вт 1% [0805]; Manufacturer Part: R0805; spicePre: R; spiceSymbolName: Резистор 12кОм 0,125Вт 1% [0805]; Add into BOM: yes; FootprintName: R0805; ModelName: R0805
VD701 = Светодиод YLED0805YG [0805]: Manufacturer: YONGYUTAI(永裕泰); Contributor: lcsc; Convert to PCB: yes; UniqueId: gge8a39ac9c5a17ea07; Origin Footprint: LED0805-R-RD; Device: Светодиод YLED0805YG [0805]; Symbol: Светодиод YLED0805YG [0805]; Supplier: LCSC; Supplier Part: C19171393; Manufacturer Part: YLED0805YG; JLCPCB Part Class: Extended Part; spicePre: U; spiceSymbolName: YLED0805YG; Add into BOM: yes; FootprintName: LED0805-R-RD
VD702 = Светодиод YLED0805YG [0805]: Manufacturer: YONGYUTAI(永裕泰); Contributor: lcsc; Convert to PCB: yes; UniqueId: gge963a2ceda2cbe525; Origin Footprint: LED0805-R-RD; Device: Светодиод YLED0805YG [0805]; Symbol: Светодиод YLED0805YG [0805]; Supplier: LCSC; Supplier Part: C19171393; Manufacturer Part: YLED0805YG; JLCPCB Part Class: Extended Part; spicePre: U; spiceSymbolName: YLED0805YG; Add into BOM: yes; FootprintName: LED0805-R-RD
VD703 = Светодиод YLED0805YG [0805]: Manufacturer: YONGYUTAI(永裕泰); Contributor: lcsc; Convert to PCB: yes; UniqueId: gge13a6aaed1bfb3fe8; Origin Footprint: LED0805-R-RD; Device: Светодиод YLED0805YG [0805]; Symbol: Светодиод YLED0805YG [0805]; Supplier: LCSC; Supplier Part: C19171393; Manufacturer Part: YLED0805YG; JLCPCB Part Class: Extended Part; spicePre: U; spiceSymbolName: YLED0805YG; Add into BOM: yes; FootprintName: LED0805-R-RD
VD704 = Светодиод YLED0805YG [0805]: Manufacturer: YONGYUTAI(永裕泰); Contributor: lcsc; Convert to PCB: yes; UniqueId: gge0b8fac54978ab640; Origin Footprint: LED0805-R-RD; Device: Светодиод YLED0805YG [0805]; Symbol: Светодиод YLED0805YG [0805]; Supplier: LCSC; Supplier Part: C19171393; Manufacturer Part: YLED0805YG; JLCPCB Part Class: Extended Part; spicePre: U; spiceSymbolName: YLED0805YG; Add into BOM: yes; FootprintName: LED0805-R-RD
VD705 = Светодиод YLED0805YG [0805]: Manufacturer: YONGYUTAI(永裕泰); Contributor: lcsc; Convert to PCB: yes; UniqueId: ggee0b35e8720373701; Origin Footprint: LED0805-R-RD; Device: Светодиод YLED0805YG [0805]; Symbol: Светодиод YLED0805YG [0805]; Supplier: LCSC; Supplier Part: C19171393; Manufacturer Part: YLED0805YG; JLCPCB Part Class: Extended Part; spicePre: U; spiceSymbolName: YLED0805YG; Add into BOM: yes; FootprintName: LED0805-R-RD
VD706 = Светодиод YLED0805YG [0805]: Manufacturer: YONGYUTAI(永裕泰); Contributor: lcsc; Convert to PCB: yes; UniqueId: ggee3f21d5c636bfe5a; Origin Footprint: LED0805-R-RD; Device: Светодиод YLED0805YG [0805]; Symbol: Светодиод YLED0805YG [0805]; Supplier: LCSC; Supplier Part: C19171393; Manufacturer Part: YLED0805YG; JLCPCB Part Class: Extended Part; spicePre: U; spiceSymbolName: YLED0805YG; Add into BOM: yes; FootprintName: LED0805-R-RD
VD707 = Светодиод YLED0805YG [0805]: Manufacturer: YONGYUTAI(永裕泰); Contributor: lcsc; Convert to PCB: yes; UniqueId: gge83cf10b04281cc6a; Origin Footprint: LED0805-R-RD; Device: Светодиод YLED0805YG [0805]; Symbol: Светодиод YLED0805YG [0805]; Supplier: LCSC; Supplier Part: C19171393; Manufacturer Part: YLED0805YG; JLCPCB Part Class: Extended Part; spicePre: U; spiceSymbolName: YLED0805YG; Add into BOM: yes; FootprintName: LED0805-R-RD
VD708 = Диод импульсный 1N4448 [SOD-123]: Manufacturer: YANGJIE; Manufacturer Part: 1N4448WQ; Contributor: jordanjin; Convert to PCB: yes; UniqueId: gge299cba35bc713ad4; ModelId: 5a61cd31046d4447ba73169a45a0935b; Origin Footprint: SOD-123_L2.7-W1.6-LS3.7-RD-1; Device: Диод импульсный 1N4448 [SOD-123]; Symbol: Диод импульсный 1N4448 [SOD-123]; Supplier: LCSC; JLCPCB Part Class: Extended Part; spicePre: V; spiceSymbolName: Диод импульсный 1N4448 [SOD-123]; Add into BOM: yes; FootprintName: SOD-123_L2.7-W1.6-LS3.7-RD-1; ModelName: SOD-123_L2.7-W1.6-LS3.7-RD-1
VD709 = Диод импульсный 1N4448 [SOD-123]: Manufacturer: YANGJIE; Manufacturer Part: 1N4448WQ; Contributor: jordanjin; Convert to PCB: yes; UniqueId: gge278004abc2b9fac3; ModelId: 5a61cd31046d4447ba73169a45a0935b; Origin Footprint: SOD-123_L2.7-W1.6-LS3.7-RD-1; Device: Диод импульсный 1N4448 [SOD-123]; Symbol: Диод импульсный 1N4448 [SOD-123]; Supplier: LCSC; JLCPCB Part Class: Extended Part; spicePre: V; spiceSymbolName: Диод импульсный 1N4448 [SOD-123]; Add into BOM: yes; FootprintName: SOD-123_L2.7-W1.6-LS3.7-RD-1; ModelName: SOD-123_L2.7-W1.6-LS3.7-RD-1
VD710 = Диод импульсный 1N4448 [SOD-123]: Manufacturer: YANGJIE; Manufacturer Part: 1N4448WQ; Contributor: jordanjin; Convert to PCB: yes; UniqueId: gge38fc3a89a42dec95; ModelId: 5a61cd31046d4447ba73169a45a0935b; Origin Footprint: SOD-123_L2.7-W1.6-LS3.7-RD-1; Device: Диод импульсный 1N4448 [SOD-123]; Symbol: Диод импульсный 1N4448 [SOD-123]; Supplier: LCSC; JLCPCB Part Class: Extended Part; spicePre: V; spiceSymbolName: Диод импульсный 1N4448 [SOD-123]; Add into BOM: yes; FootprintName: SOD-123_L2.7-W1.6-LS3.7-RD-1; ModelName: SOD-123_L2.7-W1.6-LS3.7-RD-1
VD711 = Диод импульсный 1N4448 [SOD-123]: Manufacturer: YANGJIE; Manufacturer Part: 1N4448WQ; Contributor: jordanjin; Convert to PCB: yes; UniqueId: ggec54daadbdaf2e705; ModelId: 5a61cd31046d4447ba73169a45a0935b; Origin Footprint: SOD-123_L2.7-W1.6-LS3.7-RD-1; Device: Диод импульсный 1N4448 [SOD-123]; Symbol: Диод импульсный 1N4448 [SOD-123]; Supplier: LCSC; JLCPCB Part Class: Extended Part; spicePre: V; spiceSymbolName: Диод импульсный 1N4448 [SOD-123]; Add into BOM: yes; FootprintName: SOD-123_L2.7-W1.6-LS3.7-RD-1; ModelName: SOD-123_L2.7-W1.6-LS3.7-RD-1
VD712 = Диод импульсный 1N4448 [SOD-123]: Manufacturer: YANGJIE; Manufacturer Part: 1N4448WQ; Contributor: jordanjin; Convert to PCB: yes; UniqueId: ggeb21afea11295044c; ModelId: 5a61cd31046d4447ba73169a45a0935b; Origin Footprint: SOD-123_L2.7-W1.6-LS3.7-RD-1; Device: Диод импульсный 1N4448 [SOD-123]; Symbol: Диод импульсный 1N4448 [SOD-123]; Supplier: LCSC; JLCPCB Part Class: Extended Part; spicePre: V; spiceSymbolName: Диод импульсный 1N4448 [SOD-123]; Add into BOM: yes; FootprintName: SOD-123_L2.7-W1.6-LS3.7-RD-1; ModelName: SOD-123_L2.7-W1.6-LS3.7-RD-1
VD713 = Диод импульсный 1N4448 [SOD-123]: Manufacturer: YANGJIE; Manufacturer Part: 1N4448WQ; Contributor: jordanjin; Convert to PCB: yes; UniqueId: ggea365b1cc8ece2bac; ModelId: 5a61cd31046d4447ba73169a45a0935b; Origin Footprint: SOD-123_L2.7-W1.6-LS3.7-RD-1; Device: Диод импульсный 1N4448 [SOD-123]; Symbol: Диод импульсный 1N4448 [SOD-123]; Supplier: LCSC; JLCPCB Part Class: Extended Part; spicePre: V; spiceSymbolName: Диод импульсный 1N4448 [SOD-123]; Add into BOM: yes; FootprintName: SOD-123_L2.7-W1.6-LS3.7-RD-1; ModelName: SOD-123_L2.7-W1.6-LS3.7-RD-1
VD714 = Диод импульсный 1N4448 [SOD-123]: Manufacturer: YANGJIE; Manufacturer Part: 1N4448WQ; Contributor: jordanjin; Convert to PCB: yes; UniqueId: gge7990b59cde48bdbf; ModelId: 5a61cd31046d4447ba73169a45a0935b; Origin Footprint: SOD-123_L2.7-W1.6-LS3.7-RD-1; Device: Диод импульсный 1N4448 [SOD-123]; Symbol: Диод импульсный 1N4448 [SOD-123]; Supplier: LCSC; JLCPCB Part Class: Extended Part; spicePre: V; spiceSymbolName: Диод импульсный 1N4448 [SOD-123]; Add into BOM: yes; FootprintName: SOD-123_L2.7-W1.6-LS3.7-RD-1; ModelName: SOD-123_L2.7-W1.6-LS3.7-RD-1
VD715 = Диод импульсный 1N4448 [SOD-123]: Manufacturer: YANGJIE; Manufacturer Part: 1N4448WQ; Contributor: jordanjin; Convert to PCB: yes; UniqueId: gge85319fdbe1f0f460; ModelId: 5a61cd31046d4447ba73169a45a0935b; Origin Footprint: SOD-123_L2.7-W1.6-LS3.7-RD-1; Device: Диод импульсный 1N4448 [SOD-123]; Symbol: Диод импульсный 1N4448 [SOD-123]; Supplier: LCSC; JLCPCB Part Class: Extended Part; spicePre: V; spiceSymbolName: Диод импульсный 1N4448 [SOD-123]; Add into BOM: yes; FootprintName: SOD-123_L2.7-W1.6-LS3.7-RD-1; ModelName: SOD-123_L2.7-W1.6-LS3.7-RD-1
VD716 = Диод импульсный 1N4448 [SOD-123]: Manufacturer: YANGJIE; Manufacturer Part: 1N4448WQ; Contributor: jordanjin; Convert to PCB: yes; UniqueId: gge6cf31a5281239282; ModelId: 5a61cd31046d4447ba73169a45a0935b; Origin Footprint: SOD-123_L2.7-W1.6-LS3.7-RD-1; Device: Диод импульсный 1N4448 [SOD-123]; Symbol: Диод импульсный 1N4448 [SOD-123]; Supplier: LCSC; JLCPCB Part Class: Extended Part; spicePre: V; spiceSymbolName: Диод импульсный 1N4448 [SOD-123]; Add into BOM: yes; FootprintName: SOD-123_L2.7-W1.6-LS3.7-RD-1; ModelName: SOD-123_L2.7-W1.6-LS3.7-RD-1
VD717 = Диод импульсный 1N4448 [SOD-123]: Manufacturer: YANGJIE; Manufacturer Part: 1N4448WQ; Contributor: jordanjin; Convert to PCB: yes; UniqueId: gge9865b45244c5345a; ModelId: 5a61cd31046d4447ba73169a45a0935b; Origin Footprint: SOD-123_L2.7-W1.6-LS3.7-RD-1; Device: Диод импульсный 1N4448 [SOD-123]; Symbol: Диод импульсный 1N4448 [SOD-123]; Supplier: LCSC; JLCPCB Part Class: Extended Part; spicePre: V; spiceSymbolName: Диод импульсный 1N4448 [SOD-123]; Add into BOM: yes; FootprintName: SOD-123_L2.7-W1.6-LS3.7-RD-1; ModelName: SOD-123_L2.7-W1.6-LS3.7-RD-1
XP701 = Вилка на плату 280373-2 шаг 2.54мм: Manufacturer: TE Connectivity; Contributor: jordanjin; Convert to PCB: yes; UniqueId: ggeea64ba86990f679f; ModelId: 874bf111cf9a4edba3a7fd05a7f96d45; Origin Footprint: CONN-TH_8P-P2.54_280373-1; Device: Вилка на плату 280373-2 шаг 2.54мм; Symbol: Вилка на плату 280373-2 шаг 2.54мм; Supplier: LCSC; Supplier Part: C306235; Manufacturer Part: 280373-2; spicePre: X; spiceSymbolName: Вилка на плату 280373-2 шаг 2.54мм; Add into BOM: yes; FootprintName: CONN-TH_8P-P2.54_280373-1; ModelName: CONN-TH_8P-P2.54_280373-1
XP702 = Вилка на плату 280372-2 шаг 2.54мм: Manufacturer: TE Connectivity; Contributor: jordanjin; Convert to PCB: yes; UniqueId: ggeeeeec7a013d77d6e; ModelId: d6e73000561a4ee09ce7b61656ebe49d; Origin Footprint: CONN-TH_DIP-6-2.54; Device: Вилка на плату 280372-2 шаг 2.54мм; Symbol: Вилка на плату 280372-2 шаг 2.54мм; Supplier: LCSC; Manufacturer Part: 280372-2; JLCPCB Part Class: Extended Part; spicePre: X; spiceSymbolName: Вилка на плату 280372-2 шаг 2.54мм; Add into BOM: yes; FootprintName: CONN-TH_DIP-6-2.54; ModelName: CONN-TH_DIP-6-2.54